# EAGLE design DRV2605 (EAGLE 9.1.3)
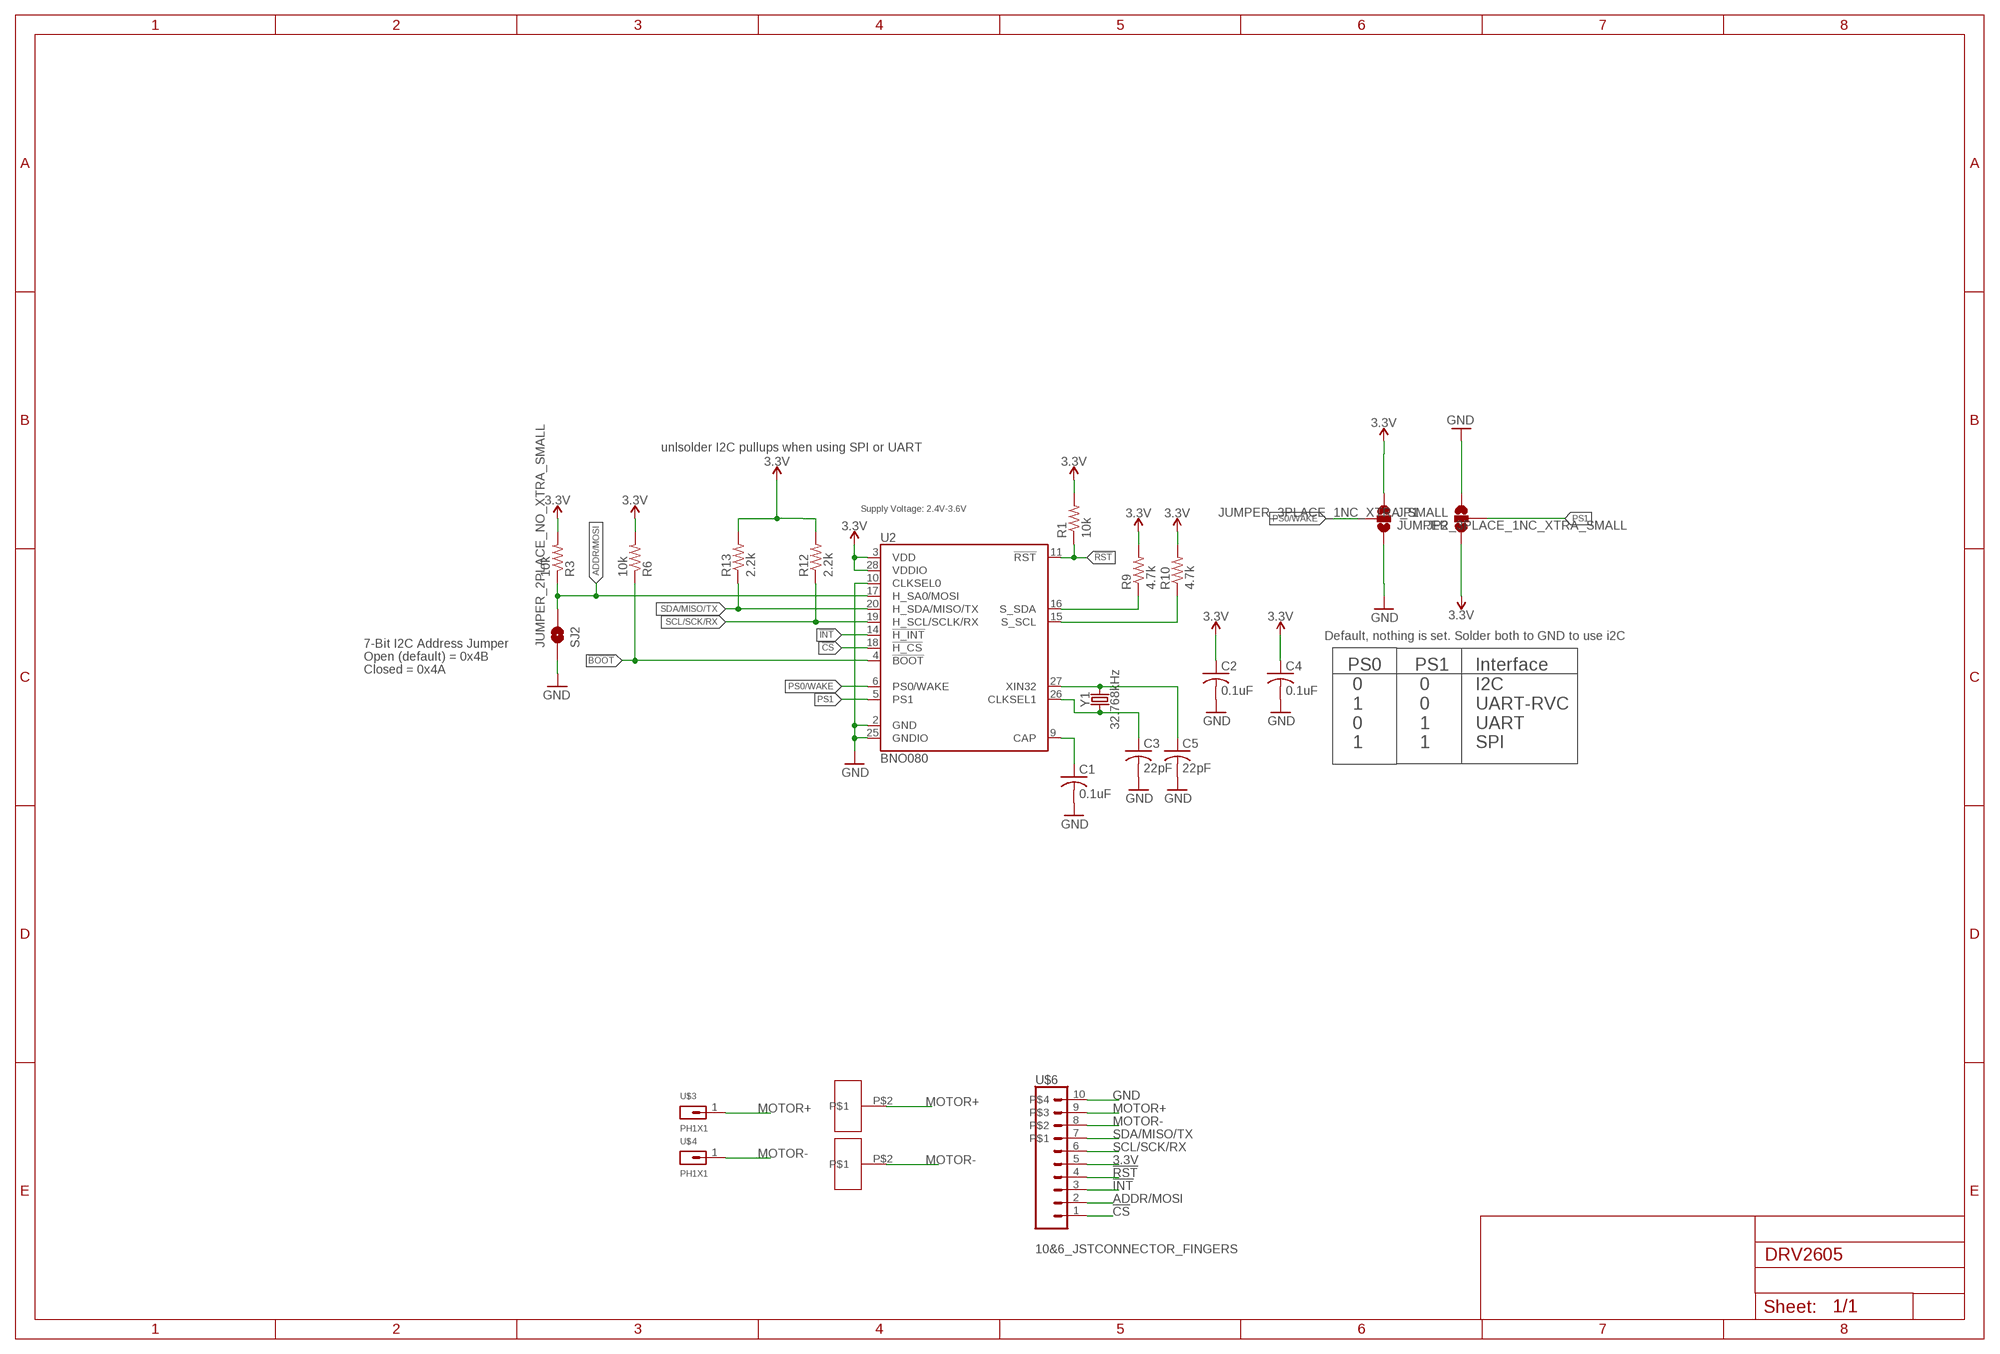
[diagram p0: schematic, sheet 1]

## Parts
C1  0.1uF  C-USC0402  [C0402]
C2  0.1uF  C-USC0402  [C0402]
C3  22pF  C-USC0402  [C0402]
C4  0.1uF  C-USC0402  [C0402]
C5  22pF  C-USC0402  [C0402]
JP1  JUMPER_3PLACE_1NC_XTRA_SMALL  [XTRA_SMAL_JUMPER_3_1_NC]
JP2  JUMPER_3PLACE_1NC_XTRA_SMALL  [XTRA_SMAL_JUMPER_3_1_NC]
R1  10k  R-US_R0402  [R0402]
R3  10k  R-US_R0402  [R0402]
R6  10k  R-US_R0402  [R0402]
R9  4.7k  R-US_R0402  [R0402]
R10  4.7k  R-US_R0402  [R0402]
R12  2.2k  R-US_R0402  [R0402]
R13  2.2k  R-US_R0402  [R0402]
SJ2  JUMPER_2PLACE_NO_XTRA_SMALL  [XTRA_SMALLJUMPER_NO]
U2  BNO080  [LGA-28]
U$1  SMD_PIN_1  [SMD_PIN]
U$2  SMD_PIN_1  [SMD_PIN]
U$3  PH1X1  [PH005-1-1]
U$4  PH1X1  [PH005-1-1]
U$6  10&6_JSTCONNECTOR_FINGERS  [10&4_HORIZONTAL_JST_CONN]
Y1  32.768kHz  CRYSTAL-32.768KHZSMD-3.2X1.5  [CRYSTAL-SMD-3.2X1.5MM]

## Nets
3.3V: C2.1 C4.1 JP1.1 JP2.1 R1.2 R3.2 R6.2 R9.2 R10.2 R12.2 R13.2 U2.3(VDD) U2.28(VDDIO) U$6.5
!BOOT: R6.1 U2.4(!BOOT)
!CS: U2.18(!H_CS) U$6.1
!INT: U2.14(!H_INT) U$6.3
!RST: R1.1 U2.11(!RST) U$6.4
ADDR/MOSI: R3.1 SJ2.2 U2.17(H_SA0/MOSI) U$6.2
CAP: C1.1 U2.9(CAP)
GND: C1.2 C2.2 C3.2 C4.2 C5.2 JP1.3 JP2.3 SJ2.1 U2.2(GND) U2.10(CLKSEL0) U2.25(GNDIO) U$6.10
MOTOR+: U$1.P$2 U$3.1 U$6.9
MOTOR-: U$2.P$2 U$4.1 U$6.8
N$1: C5.1 U2.27(XIN32) Y1.P$2
N$2: C3.1 U2.26(CLKSEL1) Y1.P$1
PS0/WAKE: JP1.2 U2.6(PS0/WAKE)
PS1: JP2.2 U2.5(PS1)
S_SCL: R10.1 U2.15(S_SCL)
S_SDA: R9.1 U2.16(S_SDA)
SCL/SCK/RX: R12.1 U2.19(H_SCL/SCLK/RX) U$6.6
SDA/MISO/TX: R13.1 U2.20(H_SDA/MISO/TX) U$6.7

## Notes on the sheet
- unlsolder I2C pullups when using SPI or UART
- Supply Voltage: 2.4V-3.6V
- Default, nothing is set. Solder both to GND to use i2C
- 7-Bit I2C Address Jumper
- Open (default) = 0x4B
- Closed = 0x4A
- PS0
   0
   1
   0
   1
- PS1
   0
   0
   1
   1
- Interface
  I2C
  UART-RVC
  UART
  SPI

## Library data of the parts
C1-C5 = rcl:C-US: CAPACITOR, American symbol; SPICEPREFIX: C
JP1 JP2 = yhtomit_jumpers:JUMPER_3PLACE_1NC_XTRA_SMALL
R1 R3 R6 R9 R10 R12 R13 = rcl:R-US_: RESISTOR, American symbol; SPICEPREFIX: R
SJ2 = yhtomit_jumpers:JUMPER_2PLACE_NO_XTRA_SMALL
U2 = SparkFun-IC-Special-Function:BNO080: Hillcrest Labs BNO080 - High Precision IMU (VR) The VR IMU uses the impressive BNO080 IMU. This IC has a combination triple axis accelerometer/gyro/magnetometer packaged with an ARM Cortex M0+ running powerful algorithms. The BNO080 Inertial Measurement Unit (IMU) produces accurate rotation vector headings, excellently suited for VR and other heading applications with a static rotation error of 2 degrees or less. It’s what we’ve been waiting for: all the sensor data is combined and drift corrected into meaningful, accurate IMU information. SparkFun Products: VR IMU (BNO080) <https://www.sparkfun.com/products/14618>; PROD_ID: SEN-13947
U$1 U$2 = yhtomit-single SMD pin:SMD_PIN_1
U$3 U$4 = pel_hdr:PH1X1
U$6 = yhtomit_connectors:10&6_JSTCONNECTOR_FINGERS
Y1 = SparkFun-Clocks:CRYSTAL-32.768KHZ: 32.768kHz Crystal Frequency: 32.768kHz Frequency Stability: ±20ppm Load Capacitance: 12.5pF (PTH-2X6 & SMD-3.2X1.5), 6pF (SMD-2X6) SparkFun Products: SparkFun BigTime Watch Kit <https://www.sparkfun.com/products/11734> SparkFun nRF52832 Breakout <https://www.sparkfun.com/products/13990> SparkFun Real Time Clock Module <https://www.sparkfun.com/products/12708>; PROD_ID: XTAL-13062

## Board
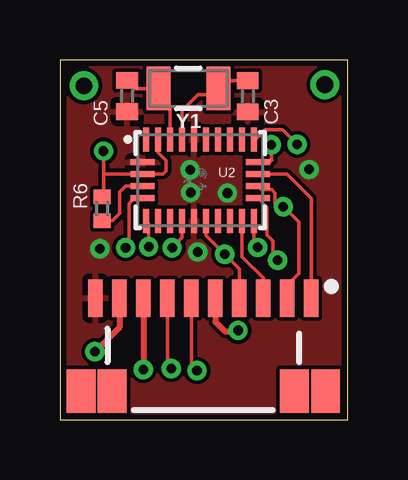
[diagram p1: board, top side]
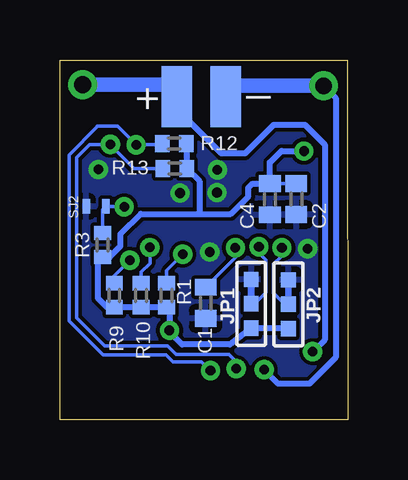
[diagram p2: board, bottom side, seen from below]

Size 12 x 15 mm. Coordinates in mm from the lower left corner, seen from the top.
Outline: 0,0 12,0 12,15 0.01,15 0,0
Copper layers (1*16): Top 0.035mm / dielectric 1.5mm / Bottom 0.035mm
Design rules "default *": minimum track width 6mil, minimum drill 0.35mm, track to track 6mil, track to pad 6mil, pad to pad 6mil, via to via 6mil, smd to smd 6mil, copper to edge 10mil, drill to drill 6mil, minimum pad ring 10mil, minimum via ring 8mil, stop-mask expansion 4mil, vias tented up to drill 0mil, thermal gap 10mil

### Footprints (pad centres in the part's own frame; a part is rotated, then mirrored left to right if it is on the bottom)
C0402 = smd 0.7 x 0.9: 1 -0.65,0; 2 0.65,0
XTRA_SMAL_JUMPER_3_1_NC = smd 0.635 x 0.61: 1 -1.016,0; 2 0,0; 3 1.016,0
R0402 = smd 0.6 x 0.7: 1 -0.5,0; 2 0.5,0
XTRA_SMALLJUMPER_NO = smd 0.305 x 0.61: 1 -0.406,0; 2 0.406,0
LGA-28 = smd 1 x 0.25: 1 1.7,2.25; 6 -1.7,2.25; 7 -1.7,1.75; 8 -1.7,1.25; 9 -1.7,0.75; 10 -1.7,0.25; 11 -1.7,-0.25; 12 -1.7,-0.75; 13 -1.7,-1.25; 14 -1.7,-1.75; 15 -1.7,-2.25; 20 1.7,-2.25; 21 1.7,-1.75; 22 1.7,-1.25; 23 1.7,-0.75; 24 1.7,-0.25; 25 1.7,0.25; 26 1.7,0.75; 27 1.7,1.25; 28 1.7,1.75 | smd 0.25 x 1: 2 0.75,2.4; 3 0.25,2.4; 4 -0.25,2.4; 5 -0.75,2.4; 16 -0.75,-2.4; 17 -0.25,-2.4; 18 0.25,-2.4; 19 0.75,-2.4
SMD_PIN = smd 2.54 x 1.27: P$2 0,0
PH005-1-1 = drill 0.7 pad 1.016: 1 0,0
10&4_HORIZONTAL_JST_CONN = smd 0.6 x 1.55: 1 -4.5,-4.775; 2 -3.5,-4.775; 3 -2.5,-4.775; 4 -1.5,-4.775; 5 -0.5,-4.775; 6 0.5,-4.775; 7 1.5,-4.775; 8 2.5,-4.775; 9 3.5,-4.775; 10 4.5,-4.775 | smd 1.2 x 1.8: M1 -3.8,-0.9; M2 3.8,-0.9; M3 -5.1,-0.9; M4 5.1,-0.9
CRYSTAL-SMD-3.2X1.5MM = smd 1 x 1.8: P$1 -1.25,0; P$2 1.25,0

### Placement (x,y rotation side)
C1  5.92,4.87 270 bottom
C2  2.14,9.2 270 bottom
C3  7.84,13.48 270 top
C4  3.24,9.19 270 bottom
C5  2.8,13.5 270 top
JP1  4.02,4.83 90 bottom
JP2  2.47,4.81 90 bottom
R1  7.55,5.18 270 bottom
R3  10.22,7.28 270 bottom
R6  1.76,8.8 90 top
R9  9.73,5.18 270 bottom
R10  8.61,5.18 270 bottom
R12  7.23,11.51 0 bottom
R13  7.21,10.47 0 bottom
SJ2  10.49,8.89 0 bottom
U2  5.85,9.98 90 top
U$1  7.13,13.47 90 bottom
U$2  5.08,13.47 90 bottom
U$3  11.05,13.97 0 top
U$4  1,13.92 0 top
U$6  5.98,0.29 180 top
Y1  5.36,13.81 180 top

### Tracks (layer width: path | path; a pad name or v marks a point on that pad's centre or on a via)
3.3V  (via drill 0.4)
  Top 0.152: U2.28 4.1,11.13 4.42,10.81 4.42,10.36 4.3,10.24 U2.3 3.43,10.21 U2.3 1.83,10.23 1.82,10.24 | v1.82,11.2 1.82,10.24 | 1.82,10.24 1.82,9.36 R6.2
  Top 0.254: U$6.5 6.48,4.08 6.88,3.68 7.39,3.68 v7.43,3.72
  Bottom 0.152: R9.2 9.64,4.68 10.03,4.68 | C2.1 C4.1 | R12.2 6.71,11.49 | R3.2 10.15,6.78 10.41,6.52 | 4,3.79 JP1.1
  Bottom 0.254: JP1.1 4.91,3.13 6.9,3.13 7.43,3.66 v7.43,3.72 7.43,4.56 R1.2 R10.2 9.64,4.68 | 10.03,4.68 10.41,5.06 10.41,6.52 | 6.71,11.49 R13.2 6.18,9.94 6.18,8.58 | JP2.1 4,3.79 | v1.82,11.2 2.76,11.2 3.24,10.72 C4.1 3.97,9.84 4.14,9.67 4.14,9.31 4.87,8.58 6.18,8.58 | 10.15,6.78 9.92,6.78 9.47,7.23 9.47,7.73 8.62,8.58 6.18,8.58
!BOOT
  Top 0.152: U2.4 2.74,9.74 2.49,9.49 2.49,8.6 2.19,8.3 R6.1
!CS
  Top 0.152: U$6.1 10.48,9.21 9.46,10.23 U2.18
!INT
  Top 0.152: U2.14 7.6,6.79 8.49,5.9 U$6.3
!RST  (via drill 0.4)
  Top 0.152: U2.11 6.1,7.67 v6.88,6.89 7.48,6.29 U$6.4
  Bottom 0.152: v6.88,6.89 7.55,6.22 R1.1
ADDR/MOSI  (via drill 0.4)
  Top 0.152: U2.17 8.4,9.58 8.85,9.58 8.98,9.45 8.98,9 9.1,8.88 9.28,8.88 v9.32,8.88 9.96,8.24 9.96,6.1 9.48,5.62 U$6.2
  Bottom 0.152: R3.1 10.22,8.75 SJ2.2 v9.33,8.89 v9.32,8.88
CAP  (via drill 0.4)
  Top 0.152: U2.9 5.1,7.59 v4.68,7.17
  Bottom 0.152: v4.68,7.17 4.68,6.76 C1.1
GND  (via drill 0.4)
  other vias: 5.45,9.47 5.43,10.42 6.99,9.45 1.67,7.12 10.39,10.43 5.75,6.99
  pour Top: 0.05,14.97 11.92,14.97 11.92,0.05 0.05,0.05
  pour Bottom: 11.94,14.99 0.07,14.99 0.07,0.04 11.94,0.04
MOTOR+  (via drill 0.4)
  Top 0.254: U$6.9 2.48,3.85 v1.46,2.83
  Bottom 0.152: U$1.P$2 7.25,13.59 | 7.25,13.59 7.63,13.97 | 7.25,13.08 7.25,13.59
  Bottom 0.254: 7.25,13.08 5.27,11.1 4.28,11.1 3.09,12.29 1.77,12.29 0.96,11.48 0.96,3.33 v1.46,2.83
  Bottom 0.61: 7.63,13.97 U$3.1
MOTOR-  (via drill 0.4)
  Top 0.254: U$6.8 v3.48,2.08
  Bottom 0.152: U$2.P$2 4.63,13.92
  Bottom 0.254: U$4.1 0.49,13.41 0.49,2.59 1.59,1.49 2.89,1.49 v3.48,2.08
  Bottom 0.61: 4.63,13.92 U$4.1
N$1
  Top 0.152: U2.27 4.6,13.04 4.18,13.46 4.18,13.73 Y1.P$2 3.14,13.81 C5.1
N$2
  Top 0.152: U2.26 5.1,12.89 5.76,13.55 6.29,13.55 6.35,13.55 | 6.35,13.55 6.55,13.55 7.13,14.13 C3.1 | Y1.P$1 6.35,13.55
PS0/WAKE  (via drill 0.4)
  Top 0.152: v3.7,7.21 3.7,8.18 U2.6
  Bottom 0.152: v3.7,7.21 3.7,6.95 3.41,6.66 3.41,5.29 3.8,4.91 3.94,4.91 JP1.2
PS1  (via drill 0.4)
  Top 0.152: v2.74,7.16 2.89,7.31 2.89,9.01 3.11,9.23 U2.5
  Bottom 0.152: v2.74,7.16 2.74,6.83 3.09,6.48 3.09,5.29 2.69,4.89 2.55,4.89 JP2.2
S_SCL  (via drill 0.4)
  Top 0.152: U2.15 8.1,7.33 v8.25,7.18
  Bottom 0.152: R10.1 8.61,6.16 8.25,6.52 v8.25,7.18
S_SDA  (via drill 0.4)
  Top 0.152: U2.16 8.63,8.85 8.63,7.69 8.88,7.44 8.88,6.85 v9.09,6.64
  Bottom 0.152: v9.09,6.64 9.73,6 R9.1
SCL/SCK/RX  (via drill 0.4)
  Top 0.152: U2.19 8.76,10.73 8.85,10.82 8.82,10.85 v8.82,11.46 | U$6.6 5.48,2.28 v5.72,2.04
  Bottom 0.152: R12.1 7.78,11.46 v8.82,11.46 9.59,12.23 10.44,12.23 10.44,12.22 11.62,11.04 11.62,4.12 10.19,2.69 10.19,2.7 7.57,2.7 7.28,2.4 6.08,2.4 v5.72,2.04
SDA/MISO/TX  (via drill 0.4)
  Top 0.152: U2.20 8.15,11.68 8.56,12.09 9.29,12.09 v9.9,11.48 | U$6.7 4.48,2.28 v4.64,2.12
  Bottom 0.152: v9.9,11.48 9.9,11.46 | 9.9,11.46 10.77,11.46 11.3,10.93 11.3,4.25 10.13,3.08 7.52,3.08 7.15,2.71 4.94,2.71 4.64,2.41 v4.64,2.12 | R13.1 8.91,10.47 9.9,11.46

### Text on the board
bNames: _ | +